# Altium schematic sheet Sheet1.SchDoc
size A3; SheetNumber: 1; SheetTotal: 1
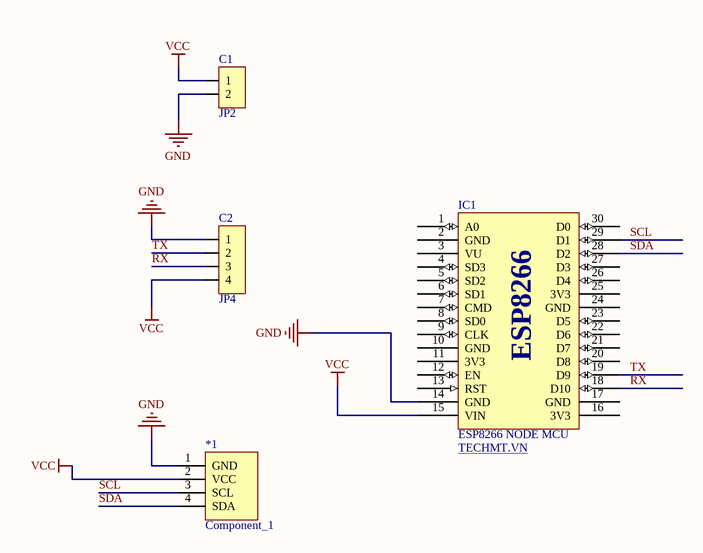
[diagram p0: Sheet1.SchDoc]

## Parts
*1  Component_1  [oledi2c]
C1  JP2  [JP2-C1T]
C2  JP4  [JP4-C1T]
IC1  ESP8266 NODE MCU  WEB: TECHMT.VN  [ESP8266 NodeMCU]

## Nets
GND: *1.1(GND) C1.2 C2.1 IC1.14(GND)
VCC: *1.2(VCC) C1.1 C2.4 IC1.15(VIN)
RX: C2.3 IC1.18(D10)
SCL: *1.3(SCL) IC1.29(D1)
SDA: *1.4(SDA) IC1.28(D2)
TX: C2.2 IC1.19(D9)

Not connected (* = marked no-connect by the designer): IC1 1(A0) 2(GND) 3(VU) 4(SD3) 5(SD2) 6(SD1) 7(CMD) 8(SD0) 9(CLK) 10(GND) 11(3V3) 12(EN) 13(RST) 16(3V3) 17(GND) 20(D8) 21(D7) 22(D6) 23(D5) 24(GND) 25(3V3) 26(D4) 27(D3) 30(D0)

## Notes on the sheet
- (in symbol ESP8266 NodeMCU) ESP8266

## Library data of the parts
C1 = JP2: WR-PHD 2.54 mm Angled Socket Header; Manufacturer: W¨¹rth Elektronik eiSos GmbH; partNo: 613002143121; ComponentLink1 Description: Manufacturer; ComponentLink2 Description: Datasheet; NoPins: 02; Created Date: 29 March 2013; ComponentLink1URL: http://www.we-online.com; ComponentLink2URL: http://katalog.we-online.de/em/datasheet/6130xx143121.pdf; Created by: Karrer Zheng
C2 = JP4: WR-PHD 2.54 mm Angled Socket Header; Manufacturer: W¨¹rth Elektronik eiSos GmbH; partNo: 613004143121; ComponentLink1 Description: Manufacturer; ComponentLink2 Description: Datasheet; NoPins: 04; Created Date: 29 March 2013; ComponentLink1URL: http://www.we-online.com; ComponentLink2URL: http://katalog.we-online.de/em/datasheet/6130xx143121.pdf; Created by: Karrer Zheng
IC1 = ESP8266 NodeMCU: LUA-ESP8266 Wifi Module Techmt.vn